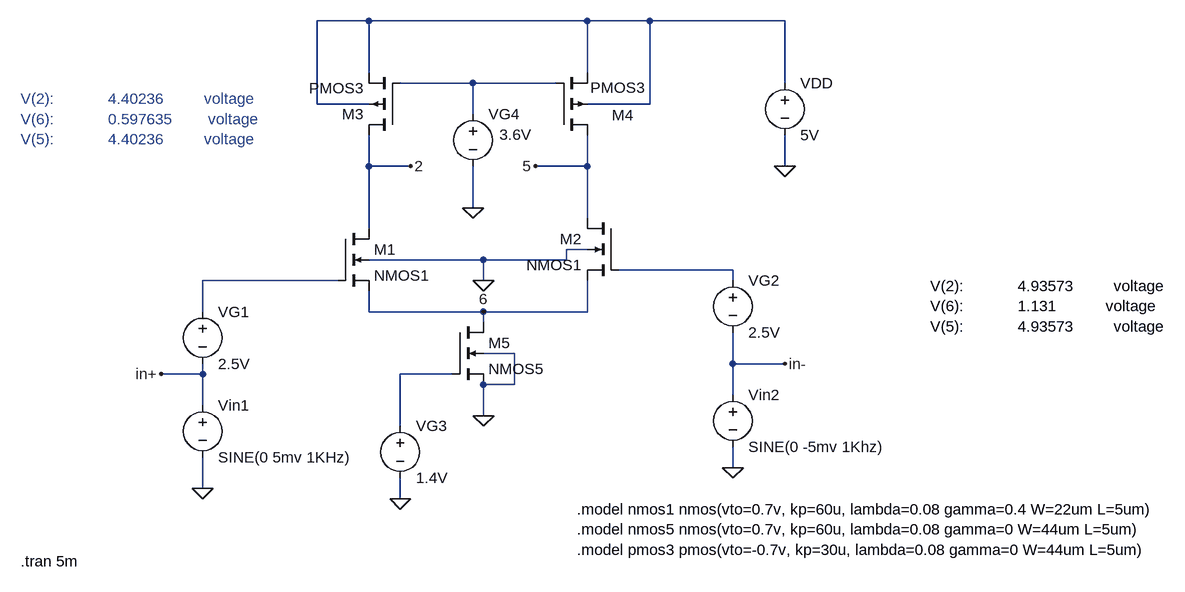
[diagram p0: schematic Differential amplifier with PMOS current source load.asc]
Differential amplifier with PMOS current source load.asc, the LTspice schematic file:
Version 4
SHEET 1 1508 768
WIRE 32 -160 -48 -160
WIRE 368 -160 32 -160
WIRE 464 -160 368 -160
WIRE 672 -160 464 -160
WIRE 32 -80 32 -160
WIRE 368 -80 368 -160
WIRE 192 -64 80 -64
WIRE 320 -64 192 -64
WIRE 672 -64 672 -160
WIRE -48 -32 -48 -160
WIRE 32 -32 -48 -32
WIRE 464 -32 464 -160
WIRE 464 -32 368 -32
WIRE 192 -16 192 -64
WIRE 32 64 32 16
WIRE 96 64 32 64
WIRE 368 64 368 16
WIRE 368 64 288 64
WIRE 672 64 672 16
WIRE 192 128 192 64
WIRE 368 144 368 64
WIRE 32 160 32 64
WIRE 368 192 336 192
WIRE 208 208 32 208
WIRE 336 208 336 192
WIRE 336 208 208 208
WIRE 592 224 416 224
WIRE -16 240 -224 240
WIRE 208 240 208 208
WIRE 592 240 592 224
WIRE -224 288 -224 240
WIRE 32 288 32 256
WIRE 208 288 32 288
WIRE 368 288 368 240
WIRE 368 288 208 288
WIRE 208 304 208 288
WIRE 256 352 208 352
WIRE 592 368 592 320
WIRE 672 368 592 368
WIRE -224 384 -224 368
WIRE -224 384 -288 384
WIRE 160 384 80 384
WIRE 256 400 256 352
WIRE 256 400 208 400
WIRE 592 416 592 368
WIRE -224 432 -224 384
WIRE 208 448 208 400
WIRE 80 464 80 384
WIRE 592 528 592 496
WIRE -224 560 -224 512
WIRE 80 576 80 544
FLAG 672 64 0
FLAG 592 528 0
FLAG 80 576 0
FLAG -224 560 0
FLAG 208 448 0
FLAG 192 128 0
FLAG 208 240 0
FLAG 96 64 2
FLAG 288 64 5
FLAG -288 384 in+
FLAG 672 368 in-
FLAG 208 288 6
SYMBOL nmos4 -16 160 R0
SYMATTR InstName M1
SYMATTR Value NMOS1
SYMBOL nmos4 160 304 R0
SYMATTR InstName M5
SYMATTR Value NMOS5
SYMBOL nmos4 416 144 M0
SYMATTR InstName M2
SYMATTR Value NMOS1
SYMBOL pmos4 80 16 R180
SYMATTR InstName M3
SYMATTR Value PMOS3
SYMBOL pmos4 320 16 M180
WINDOW 0 86 31 Left 2
WINDOW 3 53 73 Left 2
SYMATTR InstName M4
SYMATTR Value PMOS3
SYMBOL voltage 192 -32 R0
WINDOW 3 41 47 Left 2
SYMATTR Value 3.6V
SYMATTR InstName VG4
SYMBOL voltage -224 272 R0
WINDOW 123 0 0 Left 0
WINDOW 39 0 0 Left 0
SYMATTR InstName VG1
SYMATTR Value 2.5V
SYMBOL voltage -224 416 R0
WINDOW 123 0 0 Left 0
WINDOW 39 0 0 Left 0
SYMATTR InstName Vin1
SYMATTR Value SINE(0 5mv 1KHz)
SYMBOL voltage 592 224 R0
WINDOW 123 0 0 Left 0
WINDOW 39 0 0 Left 0
SYMATTR InstName VG2
SYMATTR Value 2.5V
SYMBOL voltage 592 400 R0
WINDOW 123 0 0 Left 0
WINDOW 39 0 0 Left 0
SYMATTR InstName Vin2
SYMATTR Value SINE(0 -5mv 1Khz)
SYMBOL voltage 80 448 R0
WINDOW 123 0 0 Left 0
WINDOW 39 0 0 Left 0
SYMATTR InstName VG3
SYMATTR Value 1.4V
SYMBOL voltage 672 -80 R0
WINDOW 123 0 0 Left 0
WINDOW 39 0 0 Left 0
SYMATTR InstName VDD
SYMATTR Value 5V
TEXT 352 592 Left 2 !.model nmos1 nmos(vto=0.7v, kp=60u, lambda=0.08 gamma=0.4 W=22um L=5um)\n.model nmos5 nmos(vto=0.7v, kp=60u, lambda=0.08 gamma=0 W=44um L=5um)\n.model pmos3 pmos(vto=-0.7v, kp=30u, lambda=0.08 gamma=0 W=44um L=5um)
TEXT 896 248 Left 2 !V(2):            4.93573         voltage\nV(6):            1.131           voltage\nV(5):            4.93573         voltage
TEXT -504 -40 Left 2 ;V(2):            4.40236         voltage\nV(6):            0.597635        voltage\nV(5):            4.40236         voltage
TEXT -504 672 Left 2 !.tran 5m

The netlist it stands for:
* Differential amplifier with PMOS current source load.asc
M1 2 N004 6 0 NMOS1
M5 6 N005 0 0 NMOS5
M2 5 N003 6 0 NMOS1
M3 2 N002 N001 N001 PMOS3
M4 5 N002 N001 N001 PMOS3
VG4 N002 0 3.6V
VG1 N004 in+ 2.5V
Vin1 in+ 0 SINE(0 5mv 1KHz)
VG2 N003 in- 2.5V
Vin2 in- 0 SINE(0 -5mv 1Khz)
VG3 N005 0 1.4V
VDD N001 0 5V
.model NMOS NMOS
.model PMOS PMOS
.lib standard.mos
.model nmos1 nmos(vto=0.7v, kp=60u, lambda=0.08 gamma=0.4 W=22um L=5um)
.model nmos5 nmos(vto=0.7v, kp=60u, lambda=0.08 gamma=0 W=44um L=5um)
.model pmos3 pmos(vto=-0.7v, kp=30u, lambda=0.08 gamma=0 W=44um L=5um)
V(2):            4.93573         voltage
V(6):            1.131           voltage
V(5):            4.93573         voltage
* V(2):            4.40236         voltage
* V(6):            0.597635        voltage
* V(5):            4.40236         voltage
.tran 5m
.backanno
.end